# Altium schematic sheet ArtixBank15.SchDoc
size A
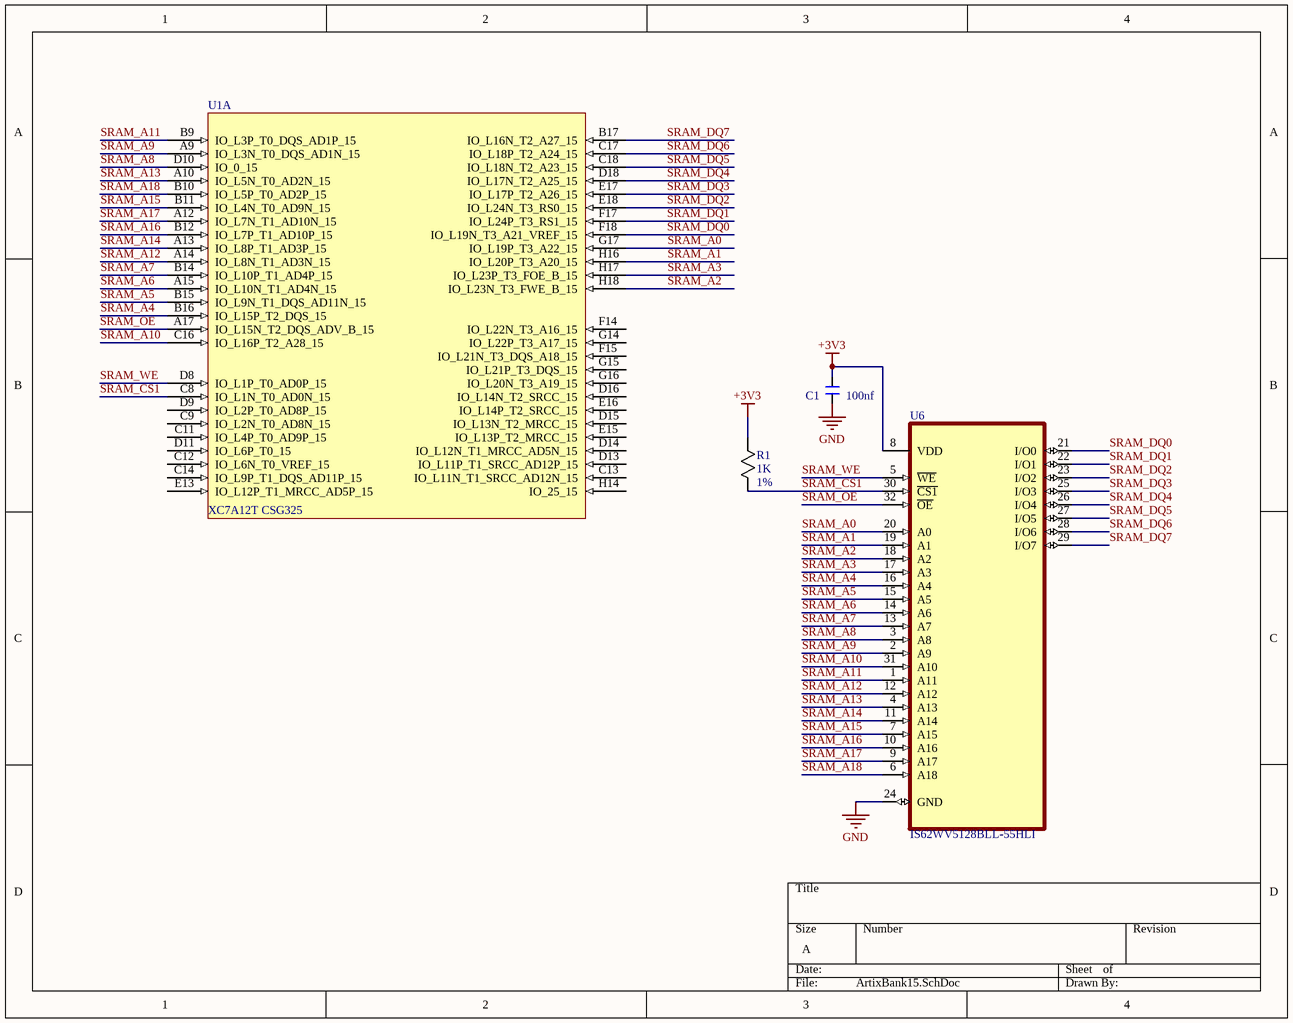
[diagram p0: ArtixBank15.SchDoc]

## Parts
C1  100nf  [0402Footprint]
R1  1K  Tolerance: 1%  [RES_CRCW_0402]
U1  XC7A12T CSG325  [BGA324C80P18X18_1500X1500X150]  (part A of 7)
U6  IS62WV5128BLL-55HLI  [SOIC50P1340X125-32N]

## Nets
+3V3: C1.1 R1.1 U6.8(VDD)
GND: C1.2 U6.24(GND)
SRAM_A0: U1.G17(IO_L19P_T3_A22_15) U6.20(A0)
SRAM_A1: U1.H16(IO_L20P_T3_A20_15) U6.19(A1)
SRAM_A2: U1.H18(IO_L23N_T3_FWE_B_15) U6.18(A2)
SRAM_A3: U1.H17(IO_L23P_T3_FOE_B_15) U6.17(A3)
SRAM_A4: U1.B16(IO_L15P_T2_DQS_15) U6.16(A4)
SRAM_A5: U1.B15(IO_L9N_T1_DQS_AD11N_15) U6.15(A5)
SRAM_A6: U1.A15(IO_L10N_T1_AD4N_15) U6.14(A6)
SRAM_A7: U1.B14(IO_L10P_T1_AD4P_15) U6.13(A7)
SRAM_A8: U1.D10(IO_0_15) U6.3(A8)
SRAM_A9: U1.A9(IO_L3N_T0_DQS_AD1N_15) U6.2(A9)
SRAM_A10: U1.C16(IO_L16P_T2_A28_15) U6.31(A10)
SRAM_A11: U1.B9(IO_L3P_T0_DQS_AD1P_15) U6.1(A11)
SRAM_A12: U1.A14(IO_L8N_T1_AD3N_15) U6.12(A12)
SRAM_A13: U1.A10(IO_L5N_T0_AD2N_15) U6.4(A13)
SRAM_A14: U1.A13(IO_L8P_T1_AD3P_15) U6.11(A14)
SRAM_A15: U1.B11(IO_L4N_T0_AD9N_15) U6.7(A15)
SRAM_A16: U1.B12(IO_L7P_T1_AD10P_15) U6.10(A16)
SRAM_A17: U1.A12(IO_L7N_T1_AD10N_15) U6.9(A17)
SRAM_A18: U1.B10(IO_L5P_T0_AD2P_15) U6.6(A18)
SRAM_~{CS1}: R1.2 U1.C8(IO_L1N_T0_AD0N_15) U6.30(~{CS1})
SRAM_DQ0: U1.F18(IO_L19N_T3_A21_VREF_15) U6.21(I/O0)
SRAM_DQ1: U1.F17(IO_L24P_T3_RS1_15) U6.22(I/O1)
SRAM_DQ2: U1.E18(IO_L24N_T3_RS0_15) U6.23(I/O2)
SRAM_DQ3: U1.E17(IO_L17P_T2_A26_15) U6.25(I/O3)
SRAM_DQ4: U1.D18(IO_L17N_T2_A25_15) U6.26(I/O4)
SRAM_DQ5: U1.C18(IO_L18N_T2_A23_15) U6.27(I/O5)
SRAM_DQ6: U1.C17(IO_L18P_T2_A24_15) U6.28(I/O6)
SRAM_DQ7: U1.B17(IO_L16N_T2_A27_15) U6.29(I/O7)
SRAM_OE: U1.A17(IO_L15N_T2_DQS_ADV_B_15) U6.32(~{OE})
SRAM_WE: U1.D8(IO_L1P_T0_AD0P_15) U6.5(~{WE})

Not connected (* = marked no-connect by the designer): U1 C9(IO_L2N_T0_AD8N_15) C11(IO_L4P_T0_AD9P_15) C12(IO_L6N_T0_VREF_15) C13(IO_L11N_T1_SRCC_AD12N_15) C14(IO_L9P_T1_DQS_AD11P_15) D9(IO_L2P_T0_AD8P_15) D11(IO_L6P_T0_15) D13(IO_L11P_T1_SRCC_AD12P_15) D14(IO_L12N_T1_MRCC_AD5N_15) D15(IO_L13N_T2_MRCC_15) D16(IO_L14N_T2_SRCC_15) E13(IO_L12P_T1_MRCC_AD5P_15) E15(IO_L13P_T2_MRCC_15) E16(IO_L14P_T2_SRCC_15) F14(IO_L22N_T3_A16_15) F15(IO_L21N_T3_DQS_A18_15) G14(IO_L22P_T3_A17_15) G15(IO_L21P_T3_DQS_15) G16(IO_L20N_T3_A19_15) H14(IO_25_15)

## Library data of the parts
C1 = 100nf_0402: 0402; Manufacturer 1: *; Manufacturer Part Number 1: *
R1 = 1k_0402: 0402; Manufacturer 1: *; Manufacturer Part Number 1: *
U1 = XC7A12T_1CSG325I
U6 = IS62WV5128BLL-55HLI: SRAM - Asynchronous Memory IC 4Mb _512K x 8_ Parallel 55ns 32-sTSOP I; MF: ISSI, Integrated; Package: LFSOP-32 ISSI; SnapEDA_Link: https://www.snapeda.com/parts/IS62WV5128BLL-55HLI/ISSI,%20Integrated%20Silicon%20Solution%20Inc/view-part/33690/?ref=snap; Digi-Key_Part_Number: IS62WV5128BLL-55HLI-TR-ND; Value: *; MP: IS62WV5128BLL-55HLI